# Altium schematic sheet Daughter_board_LCD.SchDoc: Delayed Egress
size A4; CheckedBy: DMH; Organization: Detex; Address2: 302 Detex Dr; Address3: New Braunfels, TX 78130; Address4: (830) 629-290; DocumentNumber: 107031; Revision: A0; SheetNumber: 4; SheetTotal: 9
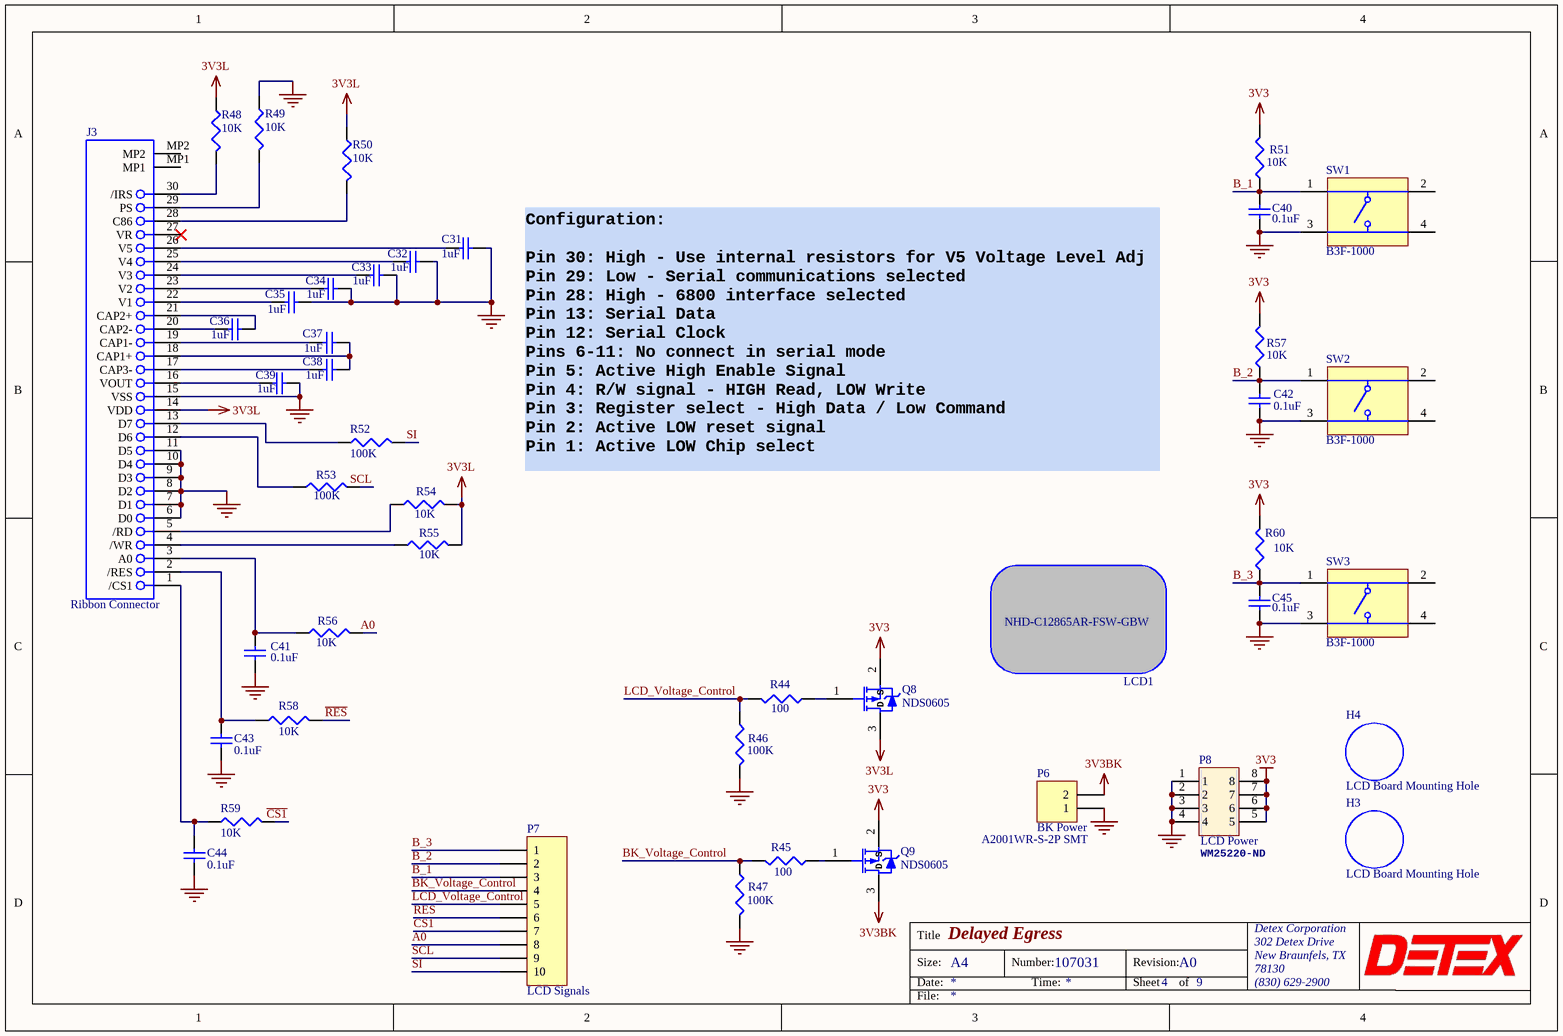
[diagram p0: Daughter_board_LCD.SchDoc]

## Parts
C31  value 1uF  [C0805]  (hidden comment: Cap)
C32  value 1uF  [C0805]  (hidden comment: Cap)
C33  value 1uF  [C0805]  (hidden comment: Cap)
C34  value 1uF  [C0805]  (hidden comment: Cap)
C35  value 1uF  [C0805]  (hidden comment: Cap)
C36  value 1uF  [C0805]  (hidden comment: Cap)
C37  value 1uF  [C0805]  (hidden comment: Cap)
C38  value 1uF  [C0805]  (hidden comment: Cap)
C39  value 1uF  [C0805]  (hidden comment: Cap)
C40  value 0.1uF  [C0805]  (hidden comment: Cap)
C41  value 0.1uF  [C0805]  (hidden comment: Cap)
C42  value 0.1uF  [C0805]  (hidden comment: Cap)
C43  value 0.1uF  [C0805]  (hidden comment: Cap)
C44  value 0.1uF  [C0805]  (hidden comment: Cap)
C45  value 0.1uF  [C0805]  (hidden comment: Cap)
H3  LCD Board Mounting Hole  [Mount Hole LCD Board]  (no BOM)
H4  LCD Board Mounting Hole  [Mount Hole LCD Board]  (no BOM)
J3  Ribbon Connector  [52892-3033]
LCD1  NHD-C12865AR-FSW-GBW
P6  BK Power  MFR P/N: A2001WR-S-2P SMT  [A2001WR-S-2P]
P7  LCD Signals  [10 pin Header]
P8  LCD Power  Supplier Part Number 1: WM25220-ND  [MOLEX 15453508]
Q8  MFR P/N: NDS0605  [SOT-23_N]  (hidden comment: MOSFET-P)
Q9  MFR P/N: NDS0605  [SOT-23_N]  (hidden comment: MOSFET-P)
R44  value 100  [6-0805_N]  (hidden comment: Res3)
R45  value 100  [6-0805_N]  (hidden comment: Res3)
R46  value 100K  [6-0805_N]  (hidden comment: Res3)
R47  value 100K  [6-0805_N]  (hidden comment: Res3)
R48  value 10K  [6-0805_N]  (hidden comment: Res3)
R49  value 10K  [6-0805_N]  (hidden comment: Res3)
R50  value 10K  [6-0805_N]  (hidden comment: Res3)
R51  value 10K  [6-0805_N]  (hidden comment: Res3)
R52  value 100K  [6-0805_N]  (hidden comment: Res3)
R53  value 100K  [6-0805_N]  (hidden comment: Res3)
R54  value 10K  [6-0805_N]  (hidden comment: Res3)
R55  value 10K  [6-0805_N]  (hidden comment: Res3)
R56  value 10K  [6-0805_N]  (hidden comment: Res3)
R57  value 10K  [6-0805_N]  (hidden comment: Res3)
R58  value 10K  [6-0805_N]  (hidden comment: Res3)
R59  value 10K  [6-0805_N]  (hidden comment: Res3)
R60  value 10K  [6-0805_N]  (hidden comment: Res3)
SW1  B3F-1000  [OMRON-B3F-1000-4_V]
SW2  B3F-1000  [OMRON-B3F-1000-4_V]
SW3  B3F-1000  [OMRON-B3F-1000-4_V]

## Nets
3V3: P8.5 P8.6 P8.7 P8.8 Q8.2(S) Q9.2(S) R51.2 R57.2 R60.2
3V3BK: P6.2 Q9.3(D)
3V3L: J3.14(VDD) Q8.3(D) R48.1 R50.1 R54.2 R55.2
GND: C31.2 C32.2 C33.2 C34.2 C35.2 C39.2 C40.2 C41.2 C42.2 C43.2 C44.2 C45.2 J3.6(D0) J3.7(D1) J3.8(D2) J3.9(D3) J3.10(D4) J3.11(D5) J3.15(VSS) P6.1 P8.1 P8.2 P8.3 P8.4 R46.2 R47.2 R49.1 SW1.3 SW2.3 SW3.3
A0: P7.8 R56.2
B_1: C40.1 P7.3 R51.1 SW1.1
B_2: C42.1 P7.2 R57.1 SW2.1
B_3: C45.1 P7.1 R60.1 SW3.1
BK_Voltage_Control: P7.4 R45.2 R47.1
~{CS1}: P7.7 R59.2
LCD_Voltage_Control: P7.5 R44.2 R46.1
~{RES}: P7.6 R58.2
SCL: P7.9 R53.2
SI: P7.10 R52.2
NetC31_1: C31.1 J3.26(V5)
NetC32_1: C32.1 J3.25(V4)
NetC33_1: C33.1 J3.24(V3)
NetC34_1: C34.1 J3.23(V2)
NetC35_1: C35.1 J3.22(V1)
NetC36_1: C36.1 J3.20(CAP2-)
NetC36_2: C36.2 J3.21(CAP2+)
NetC37_1: C37.1 J3.19(CAP1-)
NetC37_2: C37.2 C38.2 J3.18(CAP1+)
NetC38_1: C38.1 J3.17(CAP3-)
NetC39_1: C39.1 J3.16(VOUT)
NetC41_1: C41.1 J3.3(A0) R56.1
NetC43_1: C43.1 J3.2(/RES) R58.1
NetC44_1: C44.1 J3.1(/CS1) R59.1
NetJ3_4: J3.4(/WR) R55.1
NetJ3_5: J3.5(/RD) R54.1
NetJ3_12: J3.12(D6) R53.1
NetJ3_13: J3.13(D7) R52.1
NetJ3_28: J3.28(C86) R50.2
NetJ3_29: J3.29(PS) R49.2
NetJ3_30: J3.30(/IRS) R48.2
NetQ8_1: Q8.1(G) R44.1
NetQ9_1: Q9.1(G) R45.1

Not connected (* = marked no-connect by the designer): J3 27(VR)* MP1 MP2; SW1 2 4; SW2 2 4; SW3 2 4

## Notes on the sheet
- (near C31) Configuration:
  Pin 30: High - Use internal resistors for V5 Voltage Level Adj
  Pin 29: Low - Serial communications selected
  Pin 28: High - 6800 interface selected
  Pin 13: Serial Data
  Pin 12: Serial Clock
  Pins 6-11: No connect in serial mode
  Pin 5: Active High Enable Signal
  Pin 4: R/W signal - HIGH Read, LOW Write
  Pin 3: Register select - High Data / Low Command
  Pin 2: Active LOW reset signal
  Pin 1: Active LOW Chip select
- Title
- Size:
- Date:
- A4
- Number:
- Time:
- Revision:
- Sheet
- of
- Detex Corporation
- 302 Detex Drive
- New Braunfels, TX
- 78130
- (830) 629-2900
- File:

## Library data of the parts
C31-C39 = Cap: Capacitor; MFR: KEMET; MFR P/N: C0805C105K4RACTU; Voltage: 16V; PackageReference: 0805; Detex P/N: *; Case/Package: 0805; ComponentLink1Description: Datasheet; ComponentLink1URL: https://www.mouser.com/datasheet/2/212/KEM_C1002_X7R_SMD-1102033.pdf
C40-C45 = Cap: Capacitor; Detex P/N: 101727‐7; PackageReference: 0805; Case/Package: 0805; ComponentLink1Description: Datasheet
J3 = MOLX-52892-3033: 0.5 mm Pitch Easy-On(TM) Type FPC Connector, 2.0 mm Mated Height, Right Angle, ZIF, SMT, Bottom Contact, 30 Circuits, -40 to 85 degC, ELV and RoHS Compliant, Tape and Reel; Manufacturer: Molex; Stackable: No; Pitch - Mating Interface: 0.50mm; Entry Angle: 90degrees Angle; Circuits (Loaded): 30; Material - Plating Termination: Silver, Tin-Bismuth; Durability (mating cycles max): 20; Voltage (Max): 50V; PCB Retention: Yes; Material - Metal: Phosphor Bronze; Current (Max per Contact): 0.5A; Mated Height: 2.00mm; ComponentLink1Description: Manufacturer URL; PackageReference: 52892-3033; ComponentLink1URL: http://www.molex.com/molex/index.jsp; RoHS: TRUE; ComponentLink3URL: http://www.molex.com/pdm_docs/sd/528923033_sd.pdf; PCB Locator: No; ComponentLink3Description: Package Specification; Polarized to PCB: No; Packing: Tape and Reel; ComponentLink2URL: http://www.molex.com/webdocs/datasheets/pdf/en-us/0528923033_FFC_FPC_CONNECTORS.pdf; Pitch - Termination Interface: 0.50mm; Mounting Technology: Surface Mount; PartNumber: 52892-3033; Number of Rows: 1; PackageVersion: Rev. A, 05/2013; ComponentLink2Description: Datasheet; Orientation: Right Angle; Material - Plating Mating: Silver, Tin-Bismuth; Contact Position: Bottom; Detez P/N: *
LCD1 = NHD-C12865AR-FSW-GBW_1: COG LCD Module; MFR: Newhaven Display; MFR P/N: NHD-C12865AR-FSW; Detex P/N: *; ComponentLink1Description: Datasheet; ComponentLink1URL: *
P6 = Header 2: Header, 2-Pin; MFR: Newhaven Display; Detex P/N: *; ComponentLink1Description: Datasheet; ComponentLink1URL: https://www.mouser.com/datasheet/2/291/A2001-1532311.pdf
P7 = Header 10: Header, 10-Pin; MFR: Molex; Detex P/N: *; MFR P/N: *
P8 = 0015453508: Header Connector,PCB Mount,PLUG,8 Contacts,SKT,0.1 Pitch; Manufacturer: Molex; Number of Contacts: 8; Gender: Female; Connector Type: Receptacle,Socket; Max Voltage Rating (AC): 250V; Pitch: 2.54mm; Row Spacing: 0.1inch; Supplier 1: Digi-Key; Manufacturer Part Number: 0015453508; RoHS: Yes; Category: Headers and Wire Housings; Stock 1: 1406; Pricing 1: 1=5.91000, 10=5.67000, 100=4.72520, 500=4.01642, 1000=3.42577, 5000=3.07138 (USD); Mount: Surface Mount; Contact Plating: Gold; Housing Material: Polymer; Color: Black; Contact Material: Bronze; Housing Color: Black; Min Operating Temperature: -40°C; Max Operating Temperature: 105°C; Number of Rows: 2; Termination: Solder; Packaging: Tray; Number of Positions: 8; Orientation: Straight; Max Voltage Rating (DC): 250V; Length: 10.13mm; Depth: 5.05mm; ComponentLink1URL: https://datasheet.ciiva.com/6787/015453608-sd-6787655.pdf?src-supplier=Digi-Key; ComponentLink1Description: https://datasheet.ciiva.com/6787/015453608-sd-6787655.pdf?src-supplier=Digi-Key; ComponentLink2URL: https://datasheet.ciiva.com/10087/0015453508-pcb-receptacles-10087835.pdf?src-supplier=Avnet; ComponentLink2Description: https://datasheet.ciiva.com/10087/0015453508-pcb-receptacles-10087835.pdf?src-supplier=Avnet; Detex P/N: *
Q8 Q9 = MOSFET-P: P-Channel MOSFET; ComponentLink1Description: Datasheet; Detez P/N: *
R44 R45 = Res3: Resistor; MFR: Vishay; MFR P/N: CRCW0805100RJNEAC; ComponentLink1Description: Datasheet; ComponentLink1URL: https://www.mouser.com/datasheet/2/427/crcwce3-1762584.pdf; PACKAGE: 0805 SMD 1/8W; Detex P/N: *; PackageReference: 0805
R46 R47 R52 R53 = Res3: Resistor; Detex P/N: 101734-4; ComponentLink1Description: Datasheet; PACKAGE: 0805 SMD 1/8W; PackageReference: 0805; Case/Package: 0805
R48-R51 R54-R60 = Res3: Resistor; MFR: Vishay; MFR P/N: CRCW080510K0FKEAC; ComponentLink1Description: Datasheet; ComponentLink1URL: https://www.mouser.com/datasheet/2/427/crcwce3-1762584.pdf; PACKAGE: 0805 SMD 1/8W; Detex P/N: *; PackageReference: 0805; Case/Package: 0805
SW1-SW3 = CMP-1677-00002-1: Tactile Switch, SPST-NO, 0.05 A, 5 to 24 V, -25 to 70 degC, 4-Pin THD, RoHS, Bulk; MFR: Omron; ComponentLink1URL: http://www.omron.com/; ComponentLink1Description: Datasheet; MFR P/N: B3F-1000; Detex P/N: *